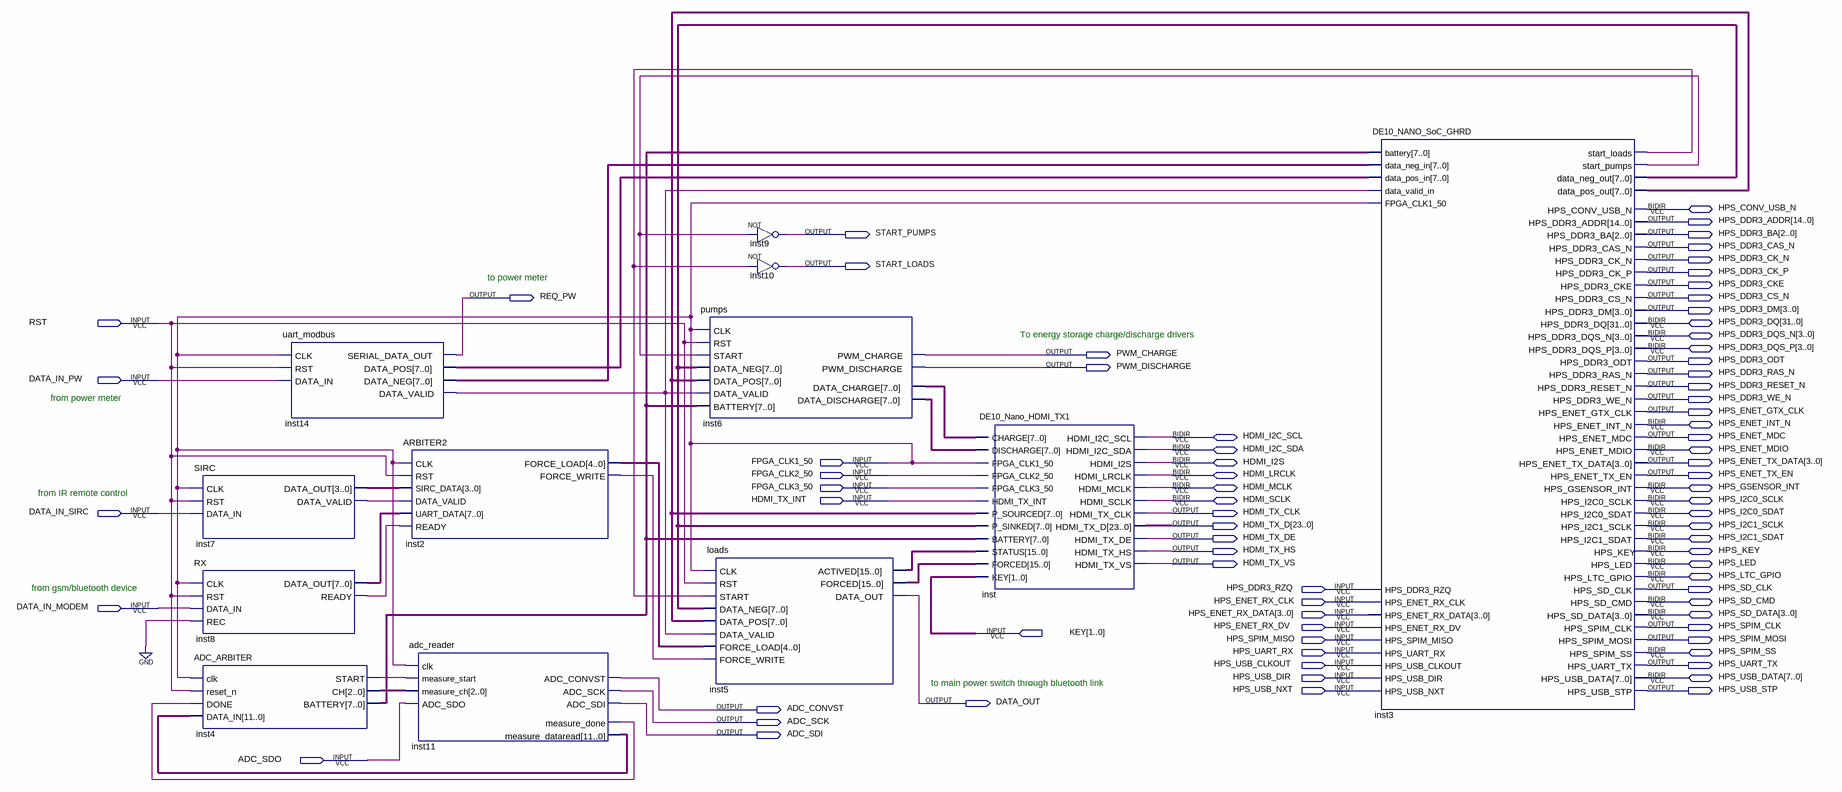
[diagram p0: schematic sheet]
// Quartus schematic smart_meter.bdf as structural Verilog: 12 symbols, 78 pins
module smart_meter (
  input  RST,
  input  DATA_IN_PW,
  input  FPGA_CLK1_50,
  input  FPGA_CLK2_50,
  input  FPGA_CLK3_50,
  input  HDMI_TX_INT,
  input  DATA_IN_SIRC,
  input  HPS_DDR3_RZQ,
  input  HPS_ENET_RX_CLK,
  input  DATA_IN_MODEM,
  input  [3:0] HPS_ENET_RX_DATA,
  input  HPS_ENET_RX_DV,
  input  [1:0] KEY,
  input  HPS_SPIM_MISO,
  input  HPS_UART_RX,
  input  HPS_USB_CLKOUT,
  input  HPS_USB_DIR,
  input  HPS_USB_NXT,
  input  ADC_SDO,
  inout  HPS_CONV_USB_N,
  inout  [31:0] HPS_DDR3_DQ,
  inout  [3:0] HPS_DDR3_DQS_N,
  inout  [3:0] HPS_DDR3_DQS_P,
  inout  HPS_ENET_INT_N,
  inout  HDMI_I2C_SCL,
  inout  HDMI_I2C_SDA,
  inout  HPS_ENET_MDIO,
  inout  HDMI_I2S,
  inout  HDMI_LRCLK,
  inout  HDMI_MCLK,
  inout  HPS_GSENSOR_INT,
  inout  HDMI_SCLK,
  inout  HPS_I2C0_SCLK,
  inout  HPS_I2C0_SDAT,
  inout  HPS_I2C1_SCLK,
  inout  HPS_I2C1_SDAT,
  inout  HPS_KEY,
  inout  HPS_LED,
  inout  HPS_LTC_GPIO,
  inout  HPS_SD_CMD,
  inout  [3:0] HPS_SD_DATA,
  inout  HPS_SPIM_SS,
  inout  [7:0] HPS_USB_DATA,
  output [14:0] HPS_DDR3_ADDR,
  output START_PUMPS,
  output [2:0] HPS_DDR3_BA,
  output HPS_DDR3_CAS_N,
  output HPS_DDR3_CK_N,
  output START_LOADS,
  output HPS_DDR3_CK_P,
  output HPS_DDR3_CKE,
  output REQ_PW,
  output HPS_DDR3_CS_N,
  output [3:0] HPS_DDR3_DM,
  output PWM_CHARGE,
  output HPS_DDR3_ODT,
  output PWM_DISCHARGE,
  output HPS_DDR3_RAS_N,
  output HPS_DDR3_RESET_N,
  output HPS_DDR3_WE_N,
  output HPS_ENET_GTX_CLK,
  output HPS_ENET_MDC,
  output [3:0] HPS_ENET_TX_DATA,
  output HPS_ENET_TX_EN,
  output HDMI_TX_CLK,
  output [23:0] HDMI_TX_D,
  output HDMI_TX_DE,
  output HDMI_TX_HS,
  output HDMI_TX_VS,
  output HPS_SD_CLK,
  output HPS_SPIM_CLK,
  output HPS_SPIM_MOSI,
  output HPS_UART_TX,
  output HPS_USB_STP,
  output DATA_OUT,
  output ADC_CONVST,
  output ADC_SCK,
  output ADC_SDI
);

  wire inst2_force_write, inst3_start_loads, inst3_start_pumps, inst4_start, inst7_data_valid, inst8_ready,
       inst11_measure_done, inst14_data_valid;
  wire [2:0] inst4_ch;
  wire [3:0] inst7_data_out;
  wire [4:0] inst2_force_load;
  wire [7:0] inst3_data_neg_out, inst3_data_pos_out, inst4_battery, inst6_data_charge, inst6_data_discharge,
       inst8_data_out, inst14_data_neg, inst14_data_pos;
  wire [11:0] inst11_measure_dataread;
  wire [15:0] inst5_actived, inst5_forced;

  SIRC inst7 (
    .CLK(FPGA_CLK1_50), .RST(RST), .DATA_IN(DATA_IN_SIRC), .DATA_OUT(inst7_data_out),
    .DATA_VALID(inst7_data_valid));
  RX inst8 (
    .CLK(FPGA_CLK1_50), .RST(RST), .DATA_IN(DATA_IN_MODEM), .REC(1'b0), .DATA_OUT(inst8_data_out),
    .READY(inst8_ready));
  ADC_ARBITER inst4 (
    .clk(FPGA_CLK1_50), .reset_n(RST), .DONE(inst11_measure_done), .DATA_IN(inst11_measure_dataread),
    .START(inst4_start), .CH(inst4_ch), .BATTERY(inst4_battery));
  uart_modbus inst14 (
    .CLK(FPGA_CLK1_50), .RST(RST), .DATA_IN(DATA_IN_PW), .SERIAL_DATA_OUT(REQ_PW),
    .DATA_POS(inst14_data_pos), .DATA_NEG(inst14_data_neg), .DATA_VALID(inst14_data_valid));
  ARBITER2 inst2 (
    .CLK(FPGA_CLK1_50), .RST(RST), .SIRC_DATA(inst7_data_out), .UART_DATA(inst8_data_out),
    .DATA_VALID(inst7_data_valid), .READY(inst8_ready), .FORCE_LOAD(inst2_force_load),
    .FORCE_WRITE(inst2_force_write));
  adc_reader inst11 (
    .clk(FPGA_CLK1_50), .measure_start(inst4_start), .measure_ch(inst4_ch), .ADC_SDO(ADC_SDO),
    .measure_done(inst11_measure_done), .measure_dataread(inst11_measure_dataread), .ADC_CONVST(ADC_CONVST),
    .ADC_SCK(ADC_SCK), .ADC_SDI(ADC_SDI));
  pumps inst6 (
    .CLK(FPGA_CLK1_50), .RST(RST), .START(inst3_start_pumps), .DATA_NEG(inst3_data_neg_out),
    .DATA_POS(inst3_data_pos_out), .DATA_VALID(inst14_data_valid), .BATTERY(inst4_battery),
    .DATA_CHARGE(inst6_data_charge), .DATA_DISCHARGE(inst6_data_discharge), .PWM_CHARGE(PWM_CHARGE),
    .PWM_DISCHARGE(PWM_DISCHARGE));
  loads inst5 (
    .CLK(FPGA_CLK1_50), .RST(RST), .START(inst3_start_loads), .DATA_NEG(inst3_data_neg_out),
    .DATA_POS(inst3_data_pos_out), .DATA_VALID(inst14_data_valid), .FORCE_LOAD(inst2_force_load),
    .FORCE_WRITE(inst2_force_write), .FORCED(inst5_forced), .ACTIVED(inst5_actived), .DATA_OUT(DATA_OUT));
  not inst9 (START_PUMPS, inst3_start_pumps);
  not inst10 (START_LOADS, inst3_start_loads);
  DE10_Nano_HDMI_TX1 inst (
    .STATUS(inst5_actived), .FORCED(inst5_forced), .CHARGE(inst6_data_charge),
    .DISCHARGE(inst6_data_discharge), .P_SOURCED(inst3_data_pos_out), .P_SINKED(inst3_data_neg_out),
    .BATTERY(inst4_battery), .FPGA_CLK1_50(FPGA_CLK1_50), .FPGA_CLK2_50(FPGA_CLK2_50),
    .FPGA_CLK3_50(FPGA_CLK3_50), .HDMI_TX_INT(HDMI_TX_INT), .KEY(KEY), .HDMI_TX_CLK(HDMI_TX_CLK),
    .HDMI_TX_D(HDMI_TX_D), .HDMI_TX_DE(HDMI_TX_DE), .HDMI_TX_HS(HDMI_TX_HS), .HDMI_TX_VS(HDMI_TX_VS),
    .HDMI_I2C_SCL(HDMI_I2C_SCL), .HDMI_I2C_SDA(HDMI_I2C_SDA), .HDMI_I2S(HDMI_I2S), .HDMI_LRCLK(HDMI_LRCLK),
    .HDMI_MCLK(HDMI_MCLK), .HDMI_SCLK(HDMI_SCLK));
  DE10_NANO_SoC_GHRD inst3 (
    .FPGA_CLK1_50(FPGA_CLK1_50), .HPS_DDR3_RZQ(HPS_DDR3_RZQ), .HPS_ENET_RX_CLK(HPS_ENET_RX_CLK),
    .HPS_ENET_RX_DATA(HPS_ENET_RX_DATA), .HPS_ENET_RX_DV(HPS_ENET_RX_DV), .HPS_SPIM_MISO(HPS_SPIM_MISO),
    .HPS_UART_RX(HPS_UART_RX), .HPS_USB_CLKOUT(HPS_USB_CLKOUT), .HPS_USB_DIR(HPS_USB_DIR),
    .HPS_USB_NXT(HPS_USB_NXT), .battery(inst4_battery), .data_neg_in(inst14_data_neg),
    .data_pos_in(inst14_data_pos), .data_valid_in(inst14_data_valid), .HPS_DDR3_ADDR(HPS_DDR3_ADDR),
    .HPS_DDR3_BA(HPS_DDR3_BA), .HPS_DDR3_CAS_N(HPS_DDR3_CAS_N), .HPS_DDR3_CK_N(HPS_DDR3_CK_N),
    .HPS_DDR3_CK_P(HPS_DDR3_CK_P), .HPS_DDR3_CKE(HPS_DDR3_CKE), .HPS_DDR3_CS_N(HPS_DDR3_CS_N),
    .HPS_DDR3_DM(HPS_DDR3_DM), .HPS_DDR3_ODT(HPS_DDR3_ODT), .HPS_DDR3_RAS_N(HPS_DDR3_RAS_N),
    .HPS_DDR3_RESET_N(HPS_DDR3_RESET_N), .HPS_DDR3_WE_N(HPS_DDR3_WE_N), .HPS_ENET_GTX_CLK(HPS_ENET_GTX_CLK),
    .HPS_ENET_MDC(HPS_ENET_MDC), .HPS_ENET_TX_DATA(HPS_ENET_TX_DATA), .HPS_ENET_TX_EN(HPS_ENET_TX_EN),
    .HPS_SD_CLK(HPS_SD_CLK), .HPS_SPIM_CLK(HPS_SPIM_CLK), .HPS_SPIM_MOSI(HPS_SPIM_MOSI),
    .HPS_UART_TX(HPS_UART_TX), .HPS_USB_STP(HPS_USB_STP), .start_loads(inst3_start_loads),
    .start_pumps(inst3_start_pumps), .data_neg_out(inst3_data_neg_out), .data_pos_out(inst3_data_pos_out),
    .HPS_CONV_USB_N(HPS_CONV_USB_N), .HPS_DDR3_DQ(HPS_DDR3_DQ), .HPS_DDR3_DQS_N(HPS_DDR3_DQS_N),
    .HPS_DDR3_DQS_P(HPS_DDR3_DQS_P), .HPS_ENET_INT_N(HPS_ENET_INT_N), .HPS_ENET_MDIO(HPS_ENET_MDIO),
    .HPS_GSENSOR_INT(HPS_GSENSOR_INT), .HPS_I2C0_SCLK(HPS_I2C0_SCLK), .HPS_I2C0_SDAT(HPS_I2C0_SDAT),
    .HPS_I2C1_SCLK(HPS_I2C1_SCLK), .HPS_I2C1_SDAT(HPS_I2C1_SDAT), .HPS_KEY(HPS_KEY), .HPS_LED(HPS_LED),
    .HPS_LTC_GPIO(HPS_LTC_GPIO), .HPS_SD_CMD(HPS_SD_CMD), .HPS_SD_DATA(HPS_SD_DATA),
    .HPS_SPIM_SS(HPS_SPIM_SS), .HPS_USB_DATA(HPS_USB_DATA));

  // Notes on the sheet:
  //   to power meter
  //   To energy storage charge/discharge drivers
  //   from power meter
  //   from IR remote control
  //   from gsm/bluetooth device
  //   to main power switch through bluetooth link
endmodule
